# Altium schematic sheet OpenPLCv0.2.0_USBPortTypeA.SchDoc
size 420 x 297 mm; PageSetup: Record=PageOptions|CenterHorizontal=True|CenterVertical=True|PrintScale=1.01|XCorrection=1.00|YCorrection=1.00|PrintKind=1|BorderSize=5000000|LeftOffset=0|BottomOffset=0|Orientation=2|PaperLength=1000|PaperWidth=1000|Scale=100|PaperSource=7|PrintQuality=-4|MediaType=1|DitherType=10|PaperKind=A3|PrintScaleMode=1; DocumentNumber: 10; SheetNumber: 10; SheetTotal: 22; SheetTitle: USB Type-A
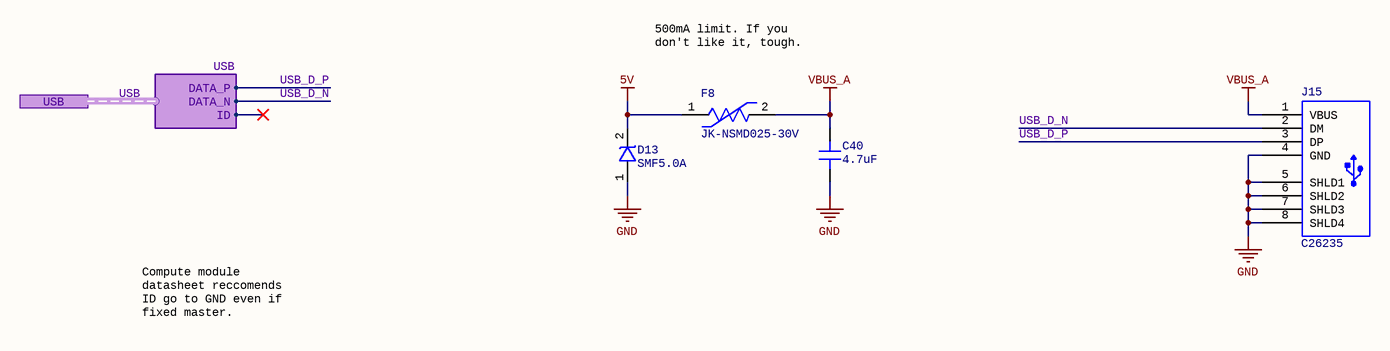
[diagram p0: OpenPLCv0.2.0_USBPortTypeA.SchDoc]

## Parts
C40  Capacitance: 4.7uF  [SMD_CAP_0603(0201)_N]  (hidden comment: CC0603KRX5R6BB475)
D13  SMF5.0A  [SOD-123FL]
F8  JK-NSMD025-30V  [SMD_RES_1206(3216)_N]
J15  C26235  [C26235]

## Ports
USB (harness USB)

## Harnesses
USB: DATA_P, DATA_N, ID

## Nets
5V: D13.2(CATHODE) F8.1
GND: C40.1 D13.1(ANODE) J15.4(GND) J15.5(SHLD1) J15.6(SHLD2) J15.7(SHLD3) J15.8(SHLD4)
VBUS_A: C40.2 F8.2 J15.1(VBUS)
USB_D_N: J15.2(DM) ; port USB.DATA_N  [project net USB.DATA_N]
USB_D_P: J15.3(DP) ; port USB.DATA_P  [project net USB.DATA_P]

## Buses and harness runs
harness USB = port USB

## Notes on the sheet
- (near F8) 500mA limit. If you don't like it, tough.
- Compute module datasheet reccomends ID go to GND even if fixed master.
- FILE NAME
- PROJECT
- TITLE
- REV
- AUTHOR
- SIZE
- SHEET
- DATE
- OF
- A3

## Library data of the parts
C40 = 4.7uF 0603 10V 10%: 4.7uF ±10% 10V X5R 0603 Multilayer Ceramic Capacitors MLCC - SMD/SMT RoHS; Package: 0603; Tolerance: 10%; Voltage Rating: 10V
D13 = SMF5.0A: Unidirectional 5V 6.4V 9.2V 21.8A SMF(SOD123FL) TVS RoHS
F8 = JK-NSMD025-30V: Polymeric 30V 500mA 0.08s 700mΩ 1206 PTC Resettable Fuses RoHS
J15 = C26235: USB - Type A Female USB 2 4 Through Hole USB Connectors RoHS